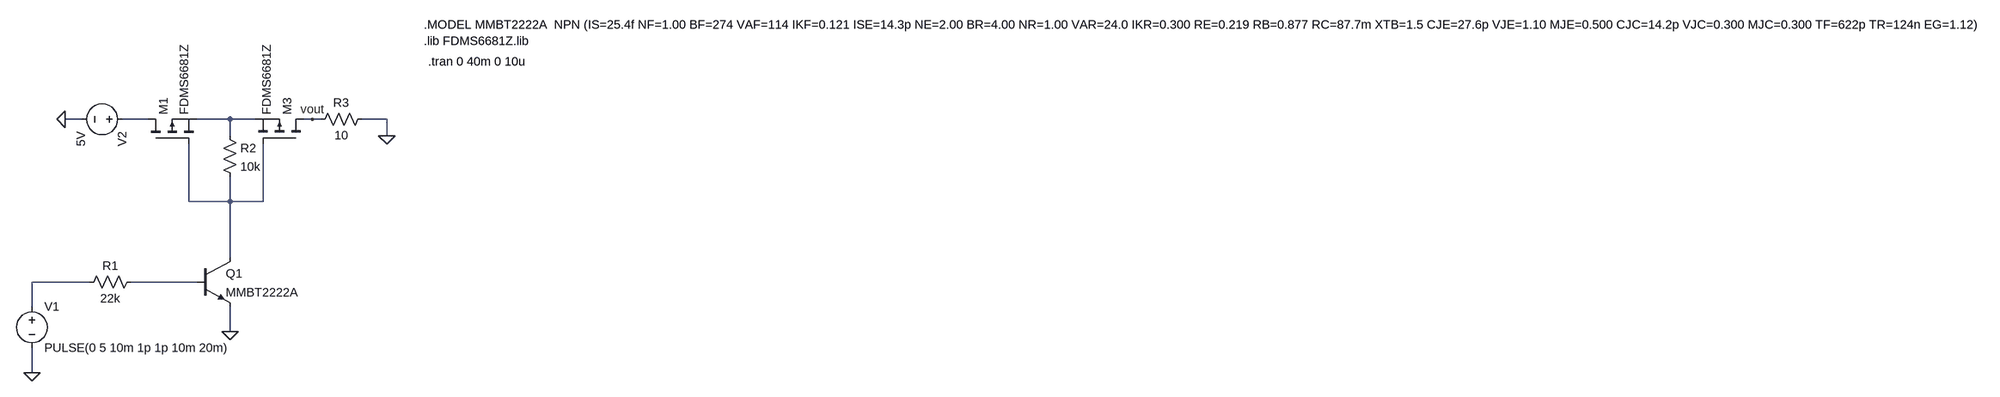
[diagram p0: schematic llave_automatica.asc]
llave_automatica.asc, the LTspice schematic file:
Version 4.1
SHEET 1 3816 680
WIRE -64 96 -96 96
WIRE 64 96 16 96
WIRE 224 96 160 96
WIRE 272 96 224 96
WIRE 384 96 368 96
WIRE 400 96 384 96
WIRE 528 96 480 96
WIRE 224 128 224 96
WIRE 528 128 528 96
WIRE 144 256 144 144
WIRE 224 256 224 208
WIRE 224 256 144 256
WIRE 288 256 288 144
WIRE 288 256 224 256
WIRE 224 384 224 256
WIRE -48 432 -160 432
WIRE 160 432 32 432
WIRE -160 480 -160 432
WIRE 224 528 224 480
WIRE -160 608 -160 560
FLAG 224 528 0
FLAG -160 608 0
FLAG -96 96 0
FLAG 384 96 vout
FLAG 528 128 0
SYMBOL pmos 64 144 R270
SYMATTR InstName M1
SYMATTR Value FDMS6681Z
SYMATTR Prefix X
SYMBOL npn 160 384 R0
SYMATTR InstName Q1
SYMATTR Value MMBT2222A
SYMBOL res 48 416 R90
WINDOW 0 0 56 VBottom 2
WINDOW 3 32 56 VTop 2
SYMATTR InstName R1
SYMATTR Value 22k
SYMBOL voltage -160 464 R0
SYMATTR InstName V1
SYMATTR Value PULSE(0 5 10m 1p 1p 10m 20m)
SYMBOL voltage 32 96 R90
WINDOW 123 0 0 Left 0
WINDOW 39 0 0 Left 0
SYMATTR InstName V2
SYMATTR Value 5V
SYMBOL pmos 368 144 M270
SYMATTR InstName M3
SYMATTR Value FDMS6681Z
SYMATTR Prefix X
SYMBOL res 208 112 R0
SYMATTR InstName R2
SYMATTR Value 10k
SYMBOL res 496 80 R90
WINDOW 0 0 56 VBottom 2
WINDOW 3 32 56 VTop 2
SYMATTR InstName R3
SYMATTR Value 10
TEXT 600 -56 Left 2 !.lib FDMS6681Z.lib
TEXT 608 -16 Left 2 !.tran 0 40m 0 10u
TEXT 600 -88 Left 2 !.MODEL MMBT2222A  NPN (IS=25.4f NF=1.00 BF=274 VAF=114 IKF=0.121 ISE=14.3p NE=2.00 BR=4.00 NR=1.00 VAR=24.0 IKR=0.300 RE=0.219 RB=0.877 RC=87.7m XTB=1.5 CJE=27.6p VJE=1.10 MJE=0.500 CJC=14.2p VJC=0.300 MJC=0.300 TF=622p TR=124n EG=1.12)

The netlist it stands for:
* llave_automatica.asc
X§M1 N001 N003 N002 FDMS6681Z  ; pins D G S
Q1 N003 N005 0 0 MMBT2222A
R1 N005 N004 22k
V1 N004 0 PULSE(0 5 10m 1p 1p 10m 20m)
V2 N001 0 5V
X§M3 vout N003 N002 FDMS6681Z  ; pins D G S
R2 N002 N003 10k
R3 0 vout 10
.model NPN NPN
.model PNP PNP
.lib standard.bjt
.lib FDMS6681Z.lib
.tran 0 40m 0 10u
.MODEL MMBT2222A  NPN (IS=25.4f NF=1.00 BF=274 VAF=114 IKF=0.121 ISE=14.3p NE=2.00 BR=4.00 NR=1.00 VAR=24.0 IKR=0.300 RE=0.219 RB=0.877 RC=87.7m XTB=1.5 CJE=27.6p VJE=1.10 MJE=0.500 CJC=14.2p VJC=0.300 MJC=0.300 TF=622p TR=124n EG=1.12)
.backanno
.end